# Altium project Expander.PrjPcb
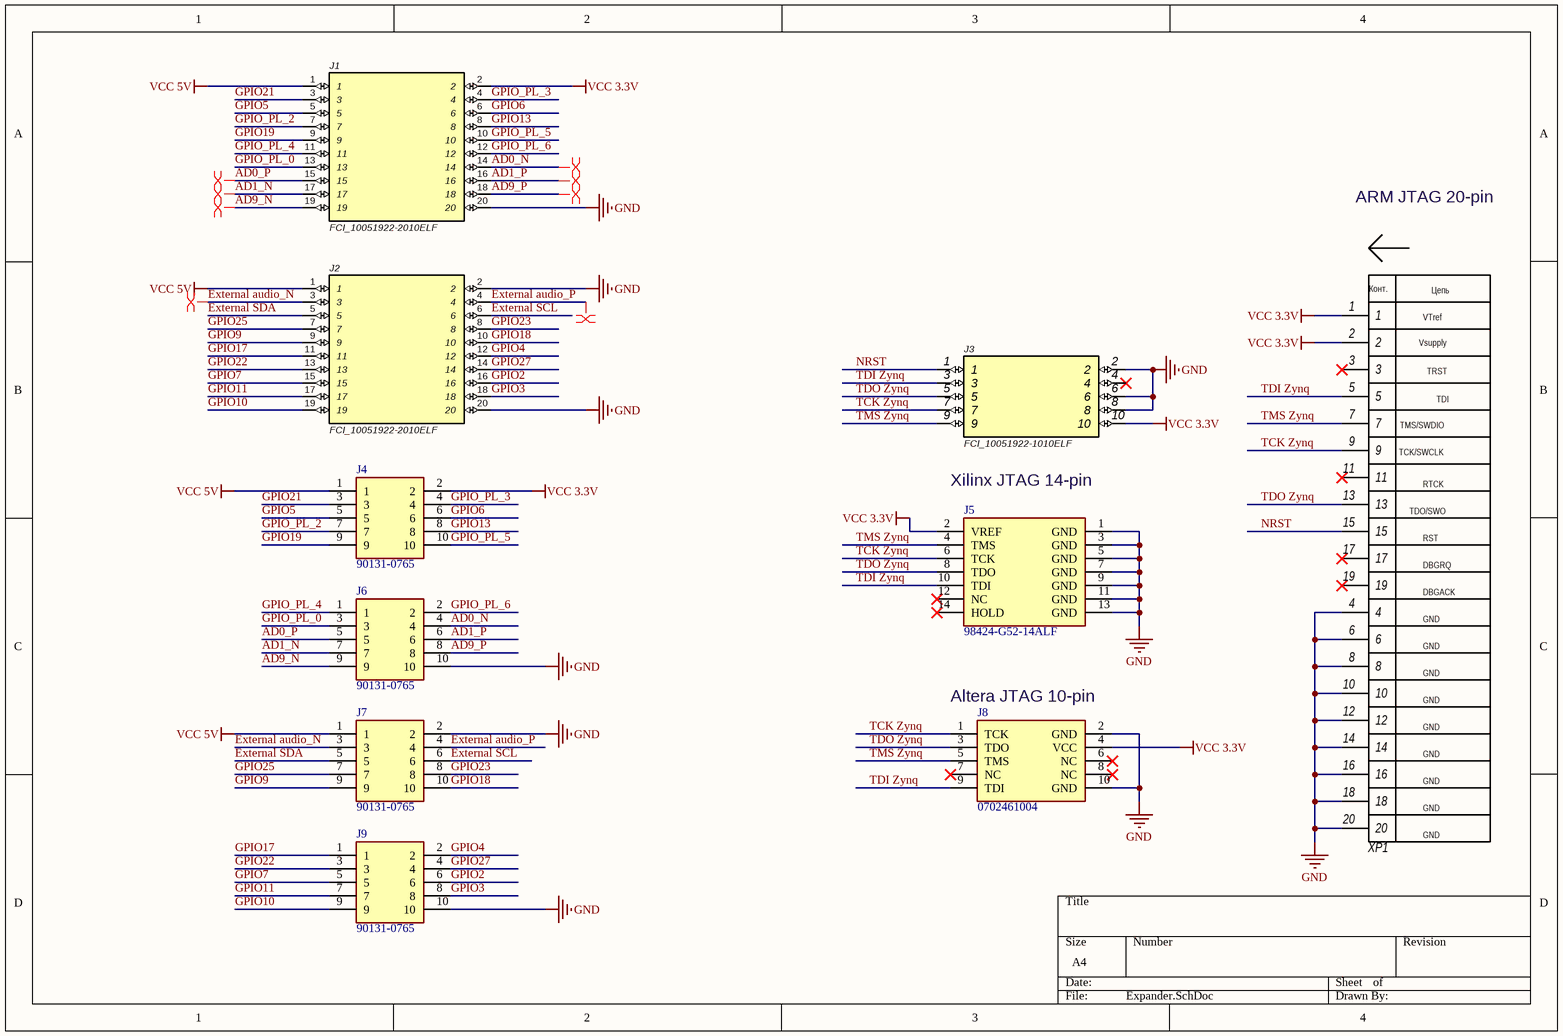
[diagram p0: Expander.SchDoc]
1 sheet, 10 parts. Net scope: global (net labels, ports and power ports of the same name join across sheets).
Board file: Expander.PcbDoc

## Sheet Expander.SchDoc
size A4

### Parts
J1  FCI_10051922-2010ELF  [*FCI_10051922-2010ELF]
J2  FCI_10051922-2010ELF  [*FCI_10051922-2010ELF]
J3  FCI_10051922-1010ELF  [*FCI_10051922-1010ELF]
J4  90131-0765  [HDRV10W90P254_2X5_1260X500X560P]
J5  98424-G52-14ALF  [98424G5214ALF]
J6  90131-0765  [HDRV10W90P254_2X5_1260X500X560P]
J7  90131-0765  [HDRV10W90P254_2X5_1260X500X560P]
J8  0702461004  [SHDR10W99P254_2X5_2032X889X947P]
J9  90131-0765  [HDRV10W90P254_2X5_1260X500X560P]
XP1  BH-20  [BH-20]  (value not drawn)

### Nets
GND: J1.20 J2.2 J2.20 J3.2 J3.6 J3.8 J5.1(GND) J5.3(GND) J5.5(GND) J5.7(GND) J5.9(GND) J5.11(GND) J5.13(GND) J6.10 J7.2 J8.2(GND) J8.10(GND) J9.10 XP1.4 XP1.6 XP1.8 XP1.10 XP1.12 XP1.14 XP1.16 XP1.18 XP1.20
VCC 3.3V: J1.2 J3.10 J4.2 J5.2(VREF) J8.4(VCC) XP1.1 XP1.2
VCC 5V: J1.1 J2.1 J4.1 J7.1
AD0_N: J1.14 J6.4
AD0_P: J1.15 J6.5
AD1_N: J1.17 J6.7
AD1_P: J1.16 J6.6
AD9_N: J1.19 J6.9
AD9_P: J1.18 J6.8
External audio_N: J2.3 J7.3
External audio_P: J2.4 J7.4
External SCL: J2.6 J7.6
External SDA: J2.5 J7.5
GPIO2: J2.16 J9.6
GPIO3: J2.18 J9.8
GPIO4: J2.12 J9.2
GPIO5: J1.5 J4.5
GPIO6: J1.6 J4.6
GPIO7: J2.15 J9.5
GPIO9: J2.9 J7.9
GPIO10: J2.19 J9.9
GPIO11: J2.17 J9.7
GPIO13: J1.8 J4.8
GPIO17: J2.11 J9.1
GPIO18: J2.10 J7.10
GPIO19: J1.9 J4.9
GPIO21: J1.3 J4.3
GPIO22: J2.13 J9.3
GPIO23: J2.8 J7.8
GPIO25: J2.7 J7.7
GPIO27: J2.14 J9.4
GPIO_PL_0: J1.13 J6.3
GPIO_PL_2: J1.7 J4.7
GPIO_PL_3: J1.4 J4.4
GPIO_PL_4: J1.11 J6.1
GPIO_PL_5: J1.10 J4.10
GPIO_PL_6: J1.12 J6.2
NRST: J3.1 XP1.15
TCK Zynq: J3.7 J5.6(TCK) J8.1(TCK) XP1.9
TDI Zynq: J3.3 J5.10(TDI) J8.9(TDI) XP1.5
TDO Zynq: J3.5 J5.8(TDO) J8.3(TDO) XP1.13
TMS Zynq: J3.9 J5.4(TMS) J8.5(TMS) XP1.7

Not connected (* = marked no-connect by the designer): J3 4*; J5 12(NC)* 14(HOLD)*; J8 6(NC)* 7(NC)* 8(NC)*; XP1 3* 11* 17* 19*

### Layout directives
differential pair: AD0_N, AD0_P, AD1_N, AD1_P, AD9_N, AD9_P, External audio_N, External audio_P

### Notes on the sheet
- ARM JTAG 20-pin
- Xilinx JTAG 14-pin
- (near J8) Altera JTAG 10-pin
- (in symbol BH-20) Конт.; Цепь; VTref; Vsupply; TRST; TDI; TMS/SWDIO; TCK/SWCLK; RTCK; TDO/SWO; RST; DBGRQ; DBGACK; GND

### Library data of the parts
J1 J2 = FCI_10051922-2010ELF: 0.50mm FFC/FPC Connectors 20CKT RA SMT ZIF CON BOTTOM CONTACT; Manufacturer 1: Amphenol FCI; Actuator Material: Nylon,Glass,Polyamide; Number of Contacts: 20; Contact Resistance: 30mR; Current Rating: 500mA; Voltage Rating: 50V; Insulation Resistance: 100MR; Pitch: 0.5mm; Supplier 1: Digi-Key; Manufacturer Part Number 1: 10051922-2010ELF; Stock 1: 913; Pricing 1: 1=0,73000, 10=0,64500, 25=0,60760, 50=0,58220, 100=0,55680, 250=0,50624, 500=0,45560, 1000=0,40498 (USD); RoHS: Yes; Mount: Surface Mount; Contact Material: Copper Alloy,Bronze,Copper; Contact Plating: Gold; Housing Color: Natural; Housing Material: Polymer; Min Operating Temperature: -55°C; Max Operating Temperature: 85°C; Number of Rows: 1; Termination: Solder; Orientation: Right Angle; Packaging: Tape and Reel; Package Quantity: 4500; Number of Positions: 20; Contact Location: Bottom; Max Voltage Rating (AC): 50V; Max Voltage Rating (DC): 50V; Length: 12.5mm; Depth: 3.4mm; Width: 3.4mm; Radiation Hardening: No; REACH SVHC: No SVHC; Lead Free: Lead Free; Flammability Rating: UL94 V-0; ComponentLink1URL: https://datasheet.ciiva.com/673/10051922-673159.pdf?src-supplier=Digi-Key; ComponentLink1Description: https://datasheet.ciiva.com/673/10051922-673159.pdf?src-supplier=Digi-Key; ComponentLink2URL: https://datasheet.ciiva.com/1437/10051922-1437497.pdf?src-supplier=Element14; ComponentLink2Description: https://datasheet.ciiva.com/1437/10051922-1437497.pdf?src-supplier=Element14; ComponentLink3URL: https://datasheet.ciiva.com/16658/10051922-16658794.pdf?src-supplier=Avnet+Europe; ComponentLink3Description: https://datasheet.ciiva.com/16658/10051922-16658794.pdf?src-supplier=Avnet+Europe; ComponentLink4URL: https://datasheet.ciiva.com/673/10051922-673158.pdf?src-supplier=Digi-Key; ComponentLink4Description: https://datasheet.ciiva.com/673/10051922-673158.pdf?src-supplier=Digi-Key; Supplier 2: Mouser; Manufacturer 2: Amphenol FCI; Manufacturer Part Number 2: 10051922-2010ELF; Stock 2: 2006; Pricing 2: 1=0,73000, 10=0,58300, 50=0,58300, 100=0,50700, 500=0,45600, 1000=0,40500, 2500=0,34600, 9000=0,30700, 10000=0,30700, 22500=0,30000 (USD); Supplier Part Number 1: 609-1240-1-ND; Supplier Part Number 2: 649-10051922-2010ELF
J3 = FCI_10051922-1010ELF: 0.50mm FFC/FPC Connectors 10CKT RA SMT ZIF CON BOTTOM CONTACT; Manufacturer 1: Amphenol FCI; Actuator Material: Nylon,Glass,Polyamide; Number of Contacts: 10; Contact Resistance: 30mR; Current Rating: 500mA; Voltage Rating: 50V; Insulation Resistance: 100MR; Gender: Female; Pitch: 0.5mm; Supplier 1: Digi-Key; Manufacturer Part Number 1: 10051922-1010ELF; Stock 1: 3851; Pricing 1: 1=0,85000, 10=0,74400, 25=0,70080, 50=0,67140, 100=0,64230, 250=0,58388, 500=0,52550, 1000=0,46710 (USD); RoHS: Yes; Mount: Surface Mount; Contact Material: Copper Alloy,Bronze; Contact Plating: Gold; Housing Color: Natural; Housing Material: Polymer; Min Operating Temperature: -55°C; Max Operating Temperature: 85°C; Number of Rows: 1; Termination: Solder; Orientation: Right Angle; Packaging: Tape and Reel; Package Quantity: 4500; Number of Positions: 10; Contact Location: Bottom; Max Voltage Rating (AC): 50V; Max Voltage Rating (DC): 50V; Length: 7.5mm; Depth: 3.4mm; Width: 3.4mm; Radiation Hardening: No; REACH SVHC: No SVHC; Lead Free: Lead Free; Flammability Rating: UL94 V-0; ComponentLink1URL: https://datasheet.ciiva.com/1437/10051922-1437495.pdf?src-supplier=Element14; ComponentLink1Description: https://datasheet.ciiva.com/1437/10051922-1437495.pdf?src-supplier=Element14; ComponentLink2URL: https://datasheet.ciiva.com/15176/getdatasheetpartid-131484-15176375.pdf?src-supplier=Verical; ComponentLink2Description: https://datasheet.ciiva.com/15176/getdatasheetpartid-131484-15176375.pdf?src-supplier=Verical; ComponentLink3URL: https://datasheet.ciiva.com/670/10051922-670057.pdf?src-supplier=Digi-Key; ComponentLink3Description: https://datasheet.ciiva.com/670/10051922-670057.pdf?src-supplier=Digi-Key; ComponentLink4URL: https://datasheet.ciiva.com/670/10051922-670058.pdf?src-supplier=Digi-Key; ComponentLink4Description: https://datasheet.ciiva.com/670/10051922-670058.pdf?src-supplier=Digi-Key; ComponentLink5URL: https://datasheet.ciiva.com/5136/fcicmd-catcustomerdrawingproductname-10051922-1010elf-5136554.pdf?src-supplier=Mouser; ComponentLink5Description: https://datasheet.ciiva.com/5136/fcicmd-catcustomerdrawingproductname-10051922-1010elf-5136554.pdf?src-supplier=Mouser; ComponentLink6URL: https://datasheet.ciiva.com/670/10051922-670059.pdf?src-supplier=Digi-Key; ComponentLink6Description: https://datasheet.ciiva.com/670/10051922-670059.pdf?src-supplier=Digi-Key; ComponentLink7URL: https://datasheet.ciiva.com/10367/10051922-10367679.pdf?src-supplier=Avnet; ComponentLink7Description: https://datasheet.ciiva.com/10367/10051922-10367679.pdf?src-supplier=Avnet; Supplier 2: Mouser; Manufacturer 2: Amphenol FCI; Manufacturer Part Number 2: 10051922-1010ELF; Stock 2: 5616; Pricing 2: 1=0,85000, 10=0,67200, 50=0,67200, 100=0,64300, 250=0,58400, 500=0,52600, 1000=0,46800, 2500=0,40300, 4500=0,38500, 9000=0,34600, 10000=0,34600 (USD); Supplier Part Number 1: 609-1234-1-ND; Supplier Part Number 2: 649-10051922-1010ELF
J4 J6 J7 J9 = 90131-0765: Connector; Manufacturer_Name: Molex; Allied_Number: 70372850; Datasheet Link: http://www.molex.com/molex/products/datasheet.jsp?part=active/0901310765_PCB_HEADERS.xml; Height: 5.6mm; Manufacturer_Part_Number: 90131-0765; Mouser Part Number: 538-90131-0765; Mouser Price/Stock: https://www.mouser.com/Search/Refine.aspx?Keyword=538-90131-0765; RS Part Number: 3606471P; RS Price/Stock: http://uk.rs-online.com/web/p/products/3606471P; Allied Price/Stock: https://www.alliedelec.com/molex-incorporated-90131-0765/70372850/
J5 = 98424-G52-14ALF: Connector; Manufacturer_Name: Amphenol; Allied_Number: 70236917; Datasheet Link: https://cdn.amphenol-icc.com/media/wysiwyg/files/drawing/98424.pdf; Height: 7mm; Manufacturer_Part_Number: 98424-G52-14ALF; Mouser Part Number: 649-98424-G52-14ALF; Mouser Price/Stock: https://www.mouser.com/Search/Refine.aspx?Keyword=649-98424-G52-14ALF; RS Part Number: 1822960; RS Price/Stock: http://uk.rs-online.com/web/p/products/1822960; Allied Price/Stock: https://www.alliedelec.com/amphenolicc-98424-g52-14alf/70236917/
J8 = 0702461004: Connector; Manufacturer_Name: Molex; Datasheet Link: http://www.molex.com/pdm_docs/sd/702461004_sd.pdf; Height: 9.47mm; Manufacturer_Part_Number: 0702461004; Mouser Part Number: N/A; Mouser Price/Stock: https://www.mouser.com/Search/Refine.aspx?Keyword=N%2FA
XP1 = BH-20: JTAG; Группа: Разъём; Производитель: *; Аналоги: *; Корпус: *; Value: BH-20